# EAGLE design RTC-Module-v12 (EAGLE 5.01)
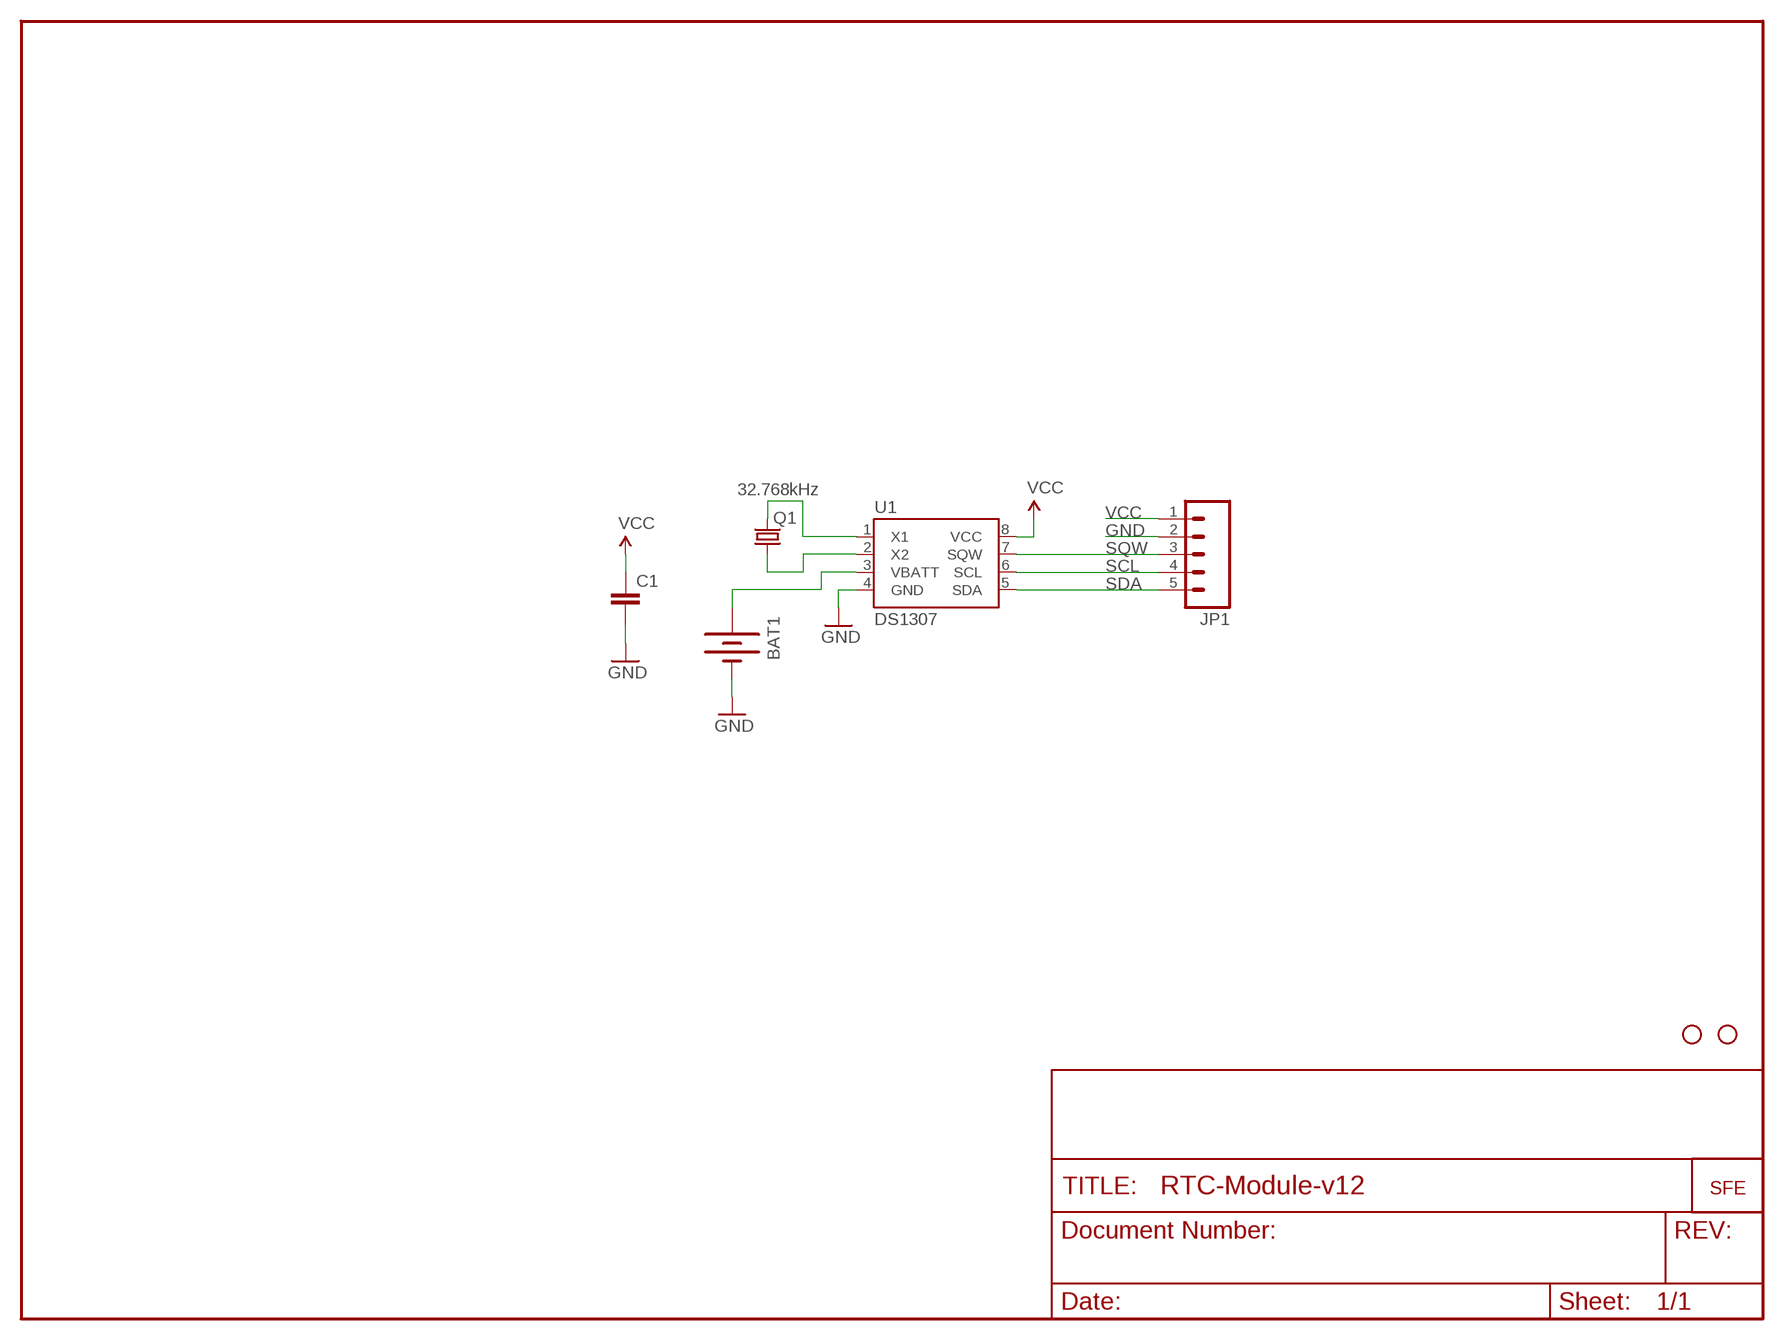
[diagram p0: schematic, sheet 1]

## Parts
BAT1  BATTERY12PTH  [BATTCON_12MM_PTH]
C1  CAP0402  [C0402]
JP1  M05  [1X05]
Q1  32.768kHz  CRYSTAL32-SMD  [CRYSTAL-32KHZ-SMD]
U1  DS1307  DS1307SO8  [SO08]
U$1  LOGO-SFESK  [SFE-LOGO-FLAME]
U$6  STAND-OFF  [STAND-OFF]
U$7  STAND-OFF  [STAND-OFF]

## Nets
GND: BAT1.GND(-) C1.2 JP1.2 U1.4(GND)
N$1: Q1.X2 U1.1(X1)
N$2: Q1.X1 U1.2(X2)
N$4: BAT1.VCC@1(+) U1.3(VBATT)
SCL: JP1.4 U1.6(SCL)
SDA: JP1.5 U1.5(SDA)
SQW: JP1.3 U1.7(SQW)
VCC: C1.1 JP1.1 U1.8(VCC)

## Library data of the parts
BAT1 = SparkFun:BATTERY: Battery Holders Various common sizes : AA, AAA, 20mm coin cell and 12mm coin cell.
C1 = SparkFun:CAP: Capacitor Standard 0603 ceramic capacitor, and 0.1" leaded capacitor.
JP1 = SparkFun:M05: Header 5 Standard 5-pin 0.1" header. Use with straight break away headers (SKU : PRT-00116), right angle break away headers (PRT-00553), swiss pins (PRT-00743), machine pins (PRT-00117), and female headers (PRT-00115). Molex polarized connector foot print use with SKU : PRT-08230 with associated crimp pins and housings.
Q1 = SparkFun:CRYSTAL: Crystals Various standard crystals. Proven footprints. Spark Fun Electronics SKU : COM-00534
U1 = SparkFun:DS1307
U$1 = SparkFun:LOGO-SFE: Spark Fun Electronics PCB Logo This is the standard Spark Fun Electronics PCB logo.
U$6 U$7 = SparkFun:STAND-OFF: Stand Off This is the mechanical footprint for a #4 phillips button head screw. Use the keepout ring to avoid running the screw head into surrounding components. SKU : PRT-00447

## Board
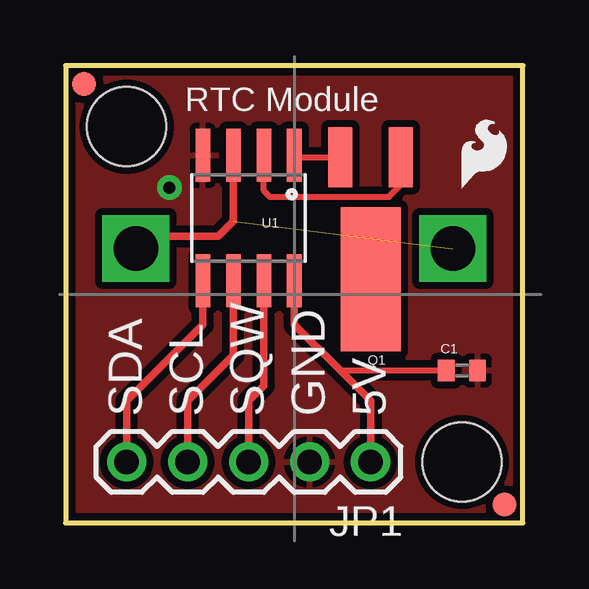
[diagram p1: board, top side]
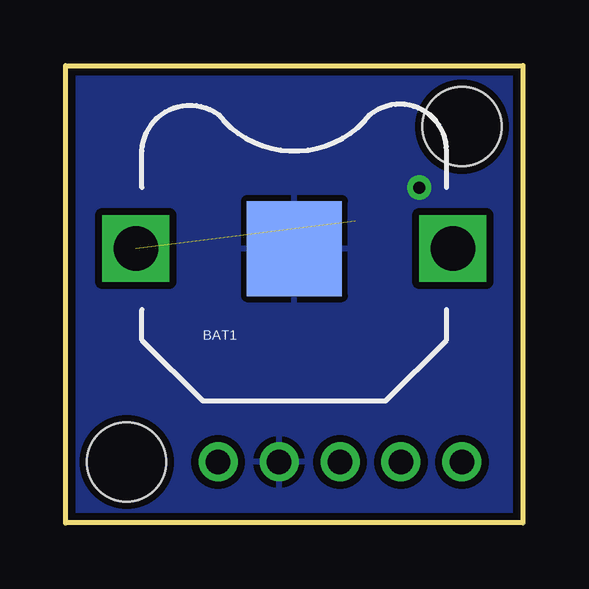
[diagram p2: board, bottom side, seen from below]

Size 19.05 x 19.05 mm. Coordinates in mm from the lower left corner, seen from the top.
Outline: 0,0 19.05,0 19.05,19.05 0,19.05 0,0
Copper layers (1*16): Top 0.035mm / dielectric 1.5mm / Bottom 0.035mm
Design rules "SparkFun": minimum track width 8mil, minimum drill 20mil, track to track 8mil, track to pad 8mil, pad to pad 8mil, via to via 8mil, smd to smd 8mil, copper to edge 10mil, drill to drill 8mil, minimum pad ring 12mil, minimum via ring 10mil, stop-mask expansion 4mil, vias tented up to drill 20mil, thermal gap 10mil

### Footprints (pad centres in the part's own frame; a part is rotated, then mirrored left to right if it is on the bottom)
BATTCON_12MM_PTH = smd 3.962 x 3.962: GND 0,0 | drill 1.854 square: VCC@1 -6.604,0; VCC@2 6.604,0
C0402 = smd 0.7 x 0.9: 1 -0.65,0; 2 0.65,0
FIDUCIAL-1X2 = smd 1 x 1: 1 0,0
1X05 = drill 1.016 round: 1 0,0; 2 2.54,0; 3 5.08,0; 4 7.62,0; 5 10.16,0
CRYSTAL-32KHZ-SMD = smd 2.5 x 6: SHEILD 0,5.08 | smd 1 x 2.5: X1 -1.27,0; X2 1.27,0
SO08 = smd 0.61 x 2.21: 1 -1.905,-2.616; 2 -0.635,-2.616; 3 0.635,-2.616; 4 1.905,-2.616; 5 1.905,2.616; 6 0.635,2.616; 7 -0.635,2.616; 8 -1.905,2.616
STAND-OFF = hole 3.302: 0,0

### Placement (x,y rotation side)
BAT1  9.53,11.43 0 bottom
C1  16.51,6.35 0 top
E$1  [FIDUCIAL-1X2]  0.76,18.29 0 top
E$2  [FIDUCIAL-1X2]  18.29,0.76 0 top
JP1  12.7,2.54 180 top
Q1  12.7,15.24 180 top
U1  7.62,12.7 180 top
U$1  16.51,13.97 0 top
U$6  16.51,2.54 0 top
U$7  2.54,16.51 0 top

### Tracks (layer width: path | path; a pad name or v marks a point on that pad's centre or on a via)
GND  (via drill 0.51)
  other vias: 4.32,13.97
  pour Bottom (isolate 0.305): 0,0 0,19.05 19.05,19.05 19.05,0
  pour Top (isolate 0.305): 0,19.05 0,0 19.05,0 19.05,19.05
N$1
  Top 0.254: U1.1 9.53,15.24 Q1.X2
N$2
  Top 0.254: Q1.X1 13.97,14.1 13.46,13.59 8.51,13.59 8.26,13.84 U1.2
  Top 0.305: U1.2 8.26,15.37
N$4  (1 unrouted)
  Top 0.305: U1.3 6.99,12.57 6.35,11.94 3.43,11.94 2.92,11.43
SCL
  Top 0.305: U1.6 6.99,6.99 5.08,5.08 JP1.4
SDA
  Top 0.305: U1.5 5.71,8.26 2.54,5.08 JP1.5
SQW
  Top 0.305: U1.7 8.26,5.71 7.62,5.08 JP1.3
VCC
  Top 0.254: 11.43,6.35 C1.1
  Top 0.305: U1.8 9.53,9.53 | 9.53,9.53 9.53,8.26 11.43,6.35 12.7,5.08 JP1.1 | 9.53,9.53 9.54,9.51

### Text on the board
tPlace: RTC Module | SDA | SCL | SQW | GND | 5V
tValues: .1 uF